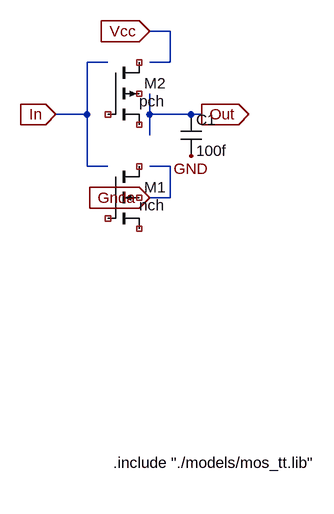
[diagram p0: schematic inverter.asc]
inverter.asc, the LTspice schematic file:
Version 4
SHEET 1 880 696
WIRE 192 16 160 16
WIRE 96 64 64 64
WIRE 192 64 192 16
WIRE 192 64 160 64
WIRE 64 144 64 64
WIRE 64 144 16 144
WIRE 160 144 160 112
WIRE 224 144 160 144
WIRE 240 144 224 144
WIRE 160 176 160 144
WIRE 64 224 64 144
WIRE 96 224 64 224
WIRE 192 224 160 224
WIRE 192 272 192 224
WIRE 192 272 160 272
FLAG 16 144 In
IOPIN 16 144 In
FLAG 240 144 Out
IOPIN 240 144 Out
FLAG 160 16 Vcc
IOPIN 160 16 In
FLAG 160 272 Gnda
IOPIN 160 272 In
FLAG 224 208 GND
SYMBOL nmos4 96 224 R0
WINDOW 3 48 60 Left 2
SYMATTR InstName M1
SYMATTR Value nch
SYMATTR Value2 l=2u w=6u
SYMBOL pmos4 96 64 R0
WINDOW 3 48 60 Left 2
SYMATTR InstName M2
SYMATTR Value pch
SYMATTR Value2 l=2u w=18u
SYMBOL cap 208 144 R0
SYMATTR InstName C1
SYMATTR Value 100f
TEXT 104 680 Left 2 !.include "./models/mos_tt.lib"\n

The netlist it stands for:
* inverter.asc
* M1: nch l=2u w=6u (symbol nmos4 not certain, pin order unknown); nets seen at it: 
* M2: pch l=2u w=18u (symbol pmos4 not certain, pin order unknown); nets seen at it: 
C1 Out GND 100f
.include "./models/mos_tt.lib"
.backanno
.end